# EAGLE schematic lights-with wires (EAGLE 5.11)
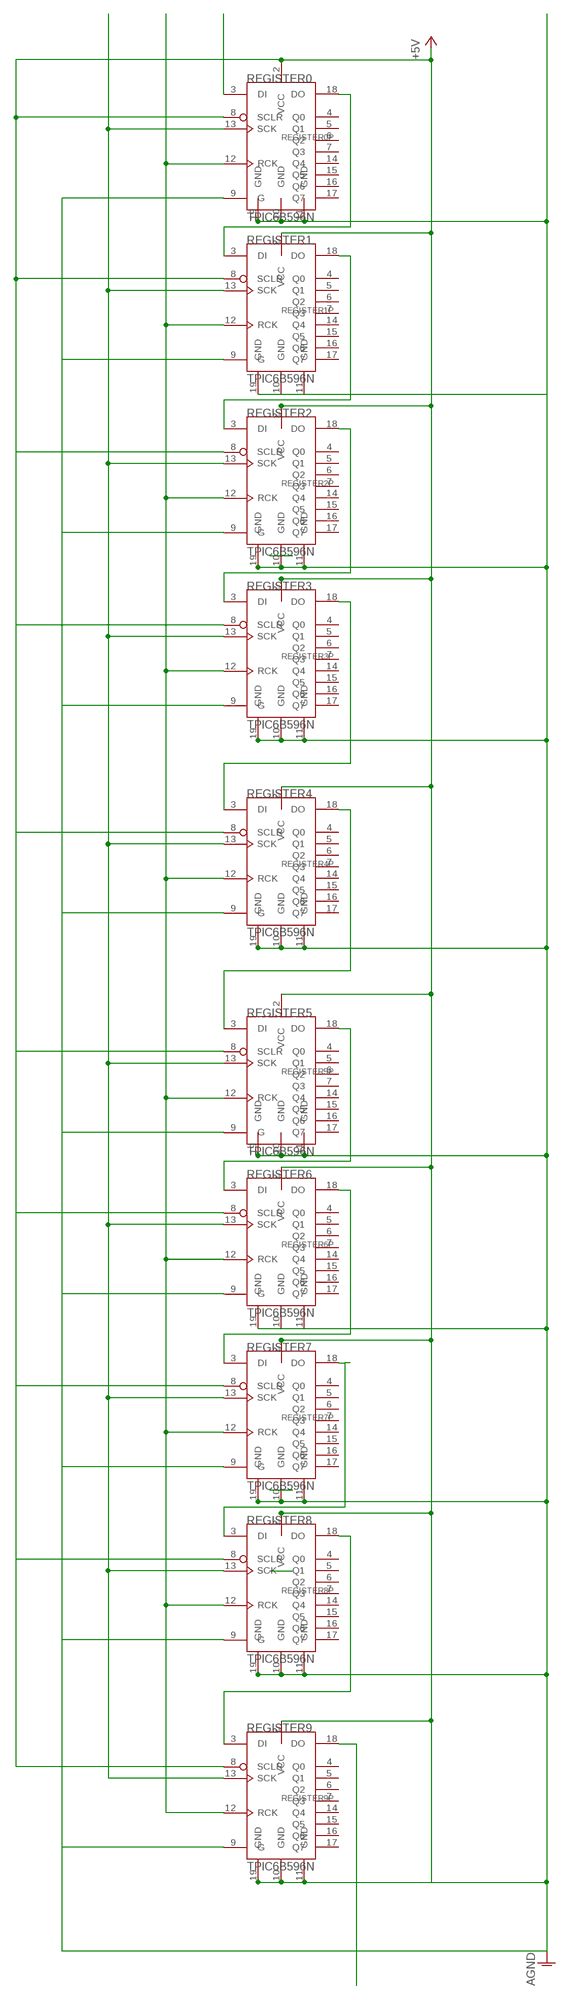
[diagram p0: schematic, sheet 1]

## Parts
REGISTER0  TPIC6B596N  [DIL20]
REGISTER1  TPIC6B596N  [DIL20]
REGISTER2  TPIC6B596N  [DIL20]
REGISTER3  TPIC6B596N  [DIL20]
REGISTER4  TPIC6B596N  [DIL20]
REGISTER5  TPIC6B596N  [DIL20]
REGISTER6  TPIC6B596N  [DIL20]
REGISTER7  TPIC6B596N  [DIL20]
REGISTER8  TPIC6B596N  [DIL20]
REGISTER9  TPIC6B596N  [DIL20]

## Nets
+5V: REGISTER0.2(VCC) REGISTER0.8(SCLR) REGISTER0.9(G) REGISTER0.10(GND) REGISTER0.11(GND) REGISTER0.18(DO) REGISTER0.19(GND) REGISTER1.2(VCC) REGISTER1.3(DI) REGISTER1.8(SCLR) REGISTER1.9(G) REGISTER1.19(GND) REGISTER2.2(VCC) REGISTER2.8(SCLR) REGISTER2.9(G) REGISTER2.10(GND) REGISTER2.11(GND) REGISTER2.19(GND) REGISTER3.2(VCC) REGISTER3.8(SCLR) REGISTER3.9(G) REGISTER3.10(GND) REGISTER3.11(GND) REGISTER3.19(GND) REGISTER4.2(VCC) REGISTER4.8(SCLR) REGISTER4.9(G) REGISTER4.10(GND) REGISTER4.11(GND) REGISTER4.19(GND) REGISTER5.2(VCC) REGISTER5.8(SCLR) REGISTER5.9(G) REGISTER5.10(GND) REGISTER5.11(GND) REGISTER5.19(GND) REGISTER6.2(VCC) REGISTER6.8(SCLR) REGISTER6.9(G) REGISTER6.19(GND) REGISTER7.2(VCC) REGISTER7.8(SCLR) REGISTER7.9(G) REGISTER7.10(GND) REGISTER7.11(GND) REGISTER7.19(GND) REGISTER8.2(VCC) REGISTER8.8(SCLR) REGISTER8.9(G) REGISTER8.10(GND) REGISTER8.11(GND) REGISTER8.19(GND) REGISTER9.2(VCC) REGISTER9.8(SCLR) REGISTER9.9(G) REGISTER9.10(GND) REGISTER9.11(GND) REGISTER9.19(GND) ; supply symbol labelled AGND
N$2: REGISTER1.18(DO) REGISTER2.3(DI)
N$3: REGISTER0.13(SCK) REGISTER1.13(SCK) REGISTER2.13(SCK) REGISTER3.13(SCK) REGISTER4.13(SCK) REGISTER5.13(SCK) REGISTER6.13(SCK) REGISTER7.13(SCK) REGISTER8.13(SCK) REGISTER9.13(SCK)
N$4: REGISTER0.12(RCK) REGISTER1.12(RCK) REGISTER2.12(RCK) REGISTER3.12(RCK) REGISTER4.12(RCK) REGISTER5.12(RCK) REGISTER6.12(RCK) REGISTER7.12(RCK) REGISTER8.12(RCK) REGISTER9.12(RCK)
N$5: REGISTER2.18(DO) REGISTER3.3(DI)
N$6: REGISTER3.18(DO) REGISTER4.3(DI)
N$7: REGISTER4.18(DO) REGISTER5.3(DI)
N$8: REGISTER5.18(DO) REGISTER6.3(DI)
N$9: REGISTER6.18(DO) REGISTER7.3(DI)
N$10: REGISTER7.18(DO) REGISTER8.3(DI)
N$11: REGISTER8.18(DO) REGISTER9.3(DI)
N$13: REGISTER9.18(DO)
Unconnected: REGISTER0.3(DI) REGISTER0.4(Q0) REGISTER0.5(Q1) REGISTER0.6(Q2) REGISTER0.7(Q3) REGISTER0.14(Q4) REGISTER0.15(Q5) REGISTER0.16(Q6) REGISTER0.17(Q7) REGISTER1.4(Q0) REGISTER1.5(Q1) REGISTER1.6(Q2) REGISTER1.7(Q3) REGISTER1.14(Q4) REGISTER1.15(Q5) REGISTER1.16(Q6) REGISTER1.17(Q7) REGISTER2.4(Q0) REGISTER2.5(Q1) REGISTER2.6(Q2) REGISTER2.7(Q3) REGISTER2.14(Q4) REGISTER2.15(Q5) REGISTER2.16(Q6) REGISTER2.17(Q7) REGISTER3.4(Q0) REGISTER3.5(Q1) REGISTER3.6(Q2) REGISTER3.7(Q3) REGISTER3.14(Q4) REGISTER3.15(Q5) REGISTER3.16(Q6) REGISTER3.17(Q7) REGISTER4.4(Q0) REGISTER4.5(Q1) REGISTER4.6(Q2) REGISTER4.7(Q3) REGISTER4.14(Q4) REGISTER4.15(Q5) REGISTER4.16(Q6) REGISTER4.17(Q7) REGISTER5.4(Q0) REGISTER5.5(Q1) REGISTER5.6(Q2) REGISTER5.7(Q3) REGISTER5.14(Q4) REGISTER5.15(Q5) REGISTER5.16(Q6) REGISTER5.17(Q7) REGISTER6.4(Q0) REGISTER6.5(Q1) REGISTER6.6(Q2) REGISTER6.7(Q3) REGISTER6.14(Q4) REGISTER6.15(Q5) REGISTER6.16(Q6) REGISTER6.17(Q7) REGISTER7.4(Q0) REGISTER7.5(Q1) REGISTER7.6(Q2) REGISTER7.7(Q3) REGISTER7.14(Q4) REGISTER7.15(Q5) REGISTER7.16(Q6) REGISTER7.17(Q7) REGISTER8.4(Q0) REGISTER8.5(Q1) REGISTER8.6(Q2) REGISTER8.7(Q3) REGISTER8.14(Q4) REGISTER8.15(Q5) REGISTER8.16(Q6) REGISTER8.17(Q7) REGISTER9.4(Q0) REGISTER9.5(Q1) REGISTER9.6(Q2) REGISTER9.7(Q3) REGISTER9.14(Q4) REGISTER9.15(Q5) REGISTER9.16(Q6) REGISTER9.17(Q7)

## Power pins joined to a net without a drawn wire
GND: REGISTER1.10(GND) REGISTER1.11(GND) REGISTER6.10(GND) REGISTER6.11(GND)

## Library data of the parts
REGISTER0 REGISTER1-REGISTER9 = tpic:TPIC6B596